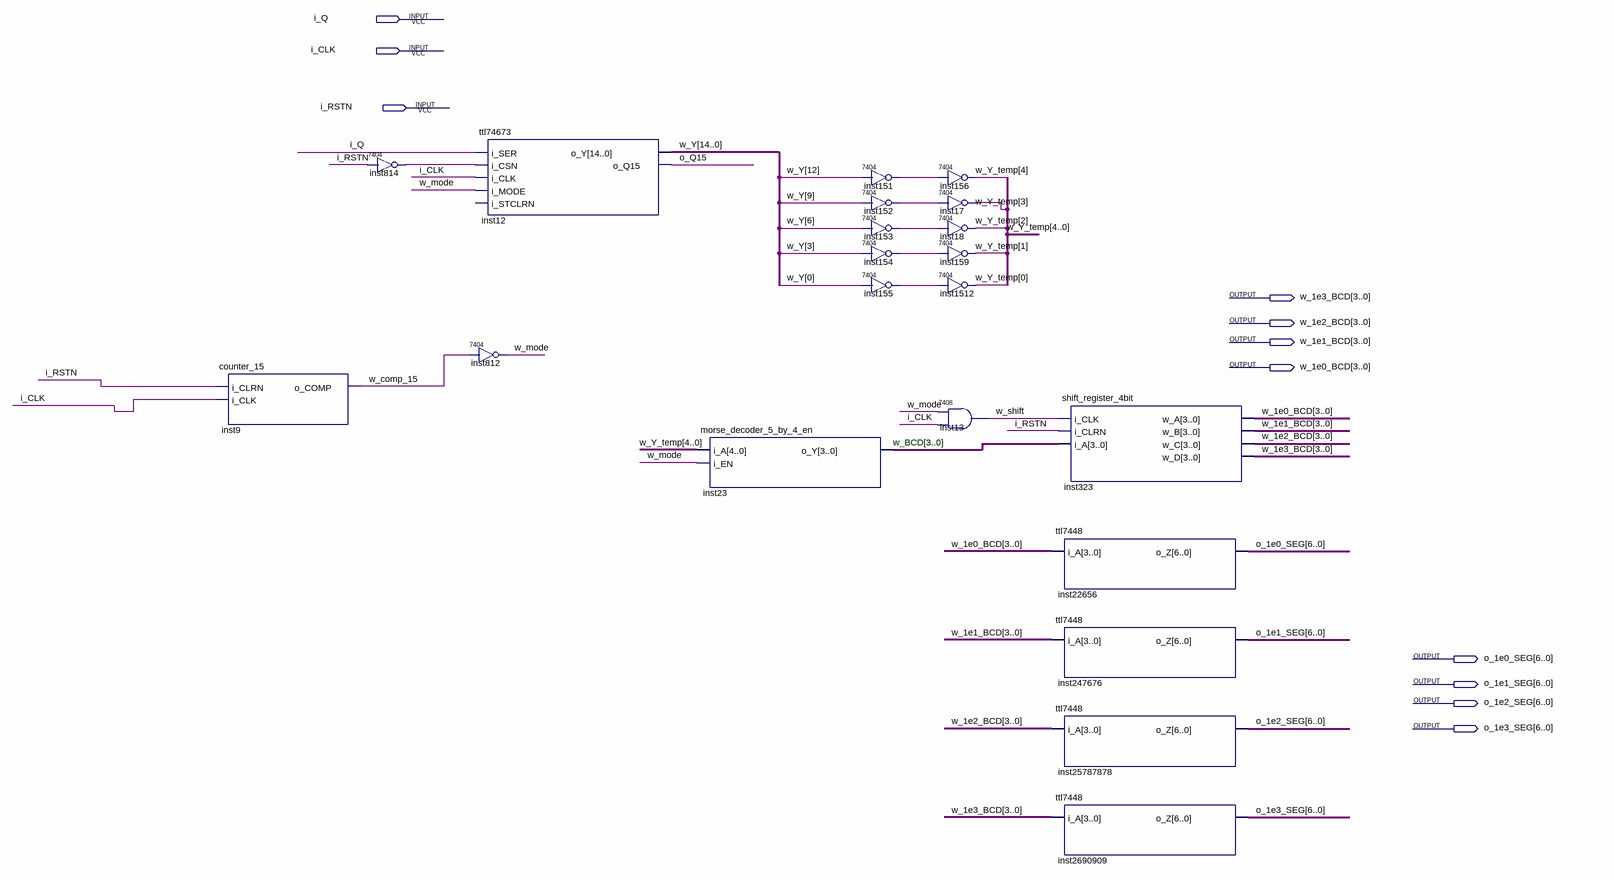
[diagram p0: schematic sheet]
// Quartus schematic receiver.bdf as structural Verilog: 21 symbols, 11 pins
module receiver (
  input  i_Q,
  input  i_CLK,
  input  i_RSTN,
  output [3:0] w_1e3_BCD,
  output [3:0] w_1e2_BCD,
  output [3:0] w_1e1_BCD,
  output [3:0] w_1e0_BCD,
  output [6:0] o_1e0_SEG,
  output [6:0] o_1e1_SEG,
  output [6:0] o_1e2_SEG,
  output [6:0] o_1e3_SEG
);

  wire inst151_1, inst152_1, inst153_1, inst154_1, inst155_1, inst814_1, o_Q15, w_comp_15, w_mode, w_shift;
  wire [3:0] w_BCD;
  wire [4:0] w_Y_temp;
  wire [14:0] w_Y;

  counter_15 inst9 (.i_CLRN(i_RSTN), .i_CLK(i_CLK), .o_COMP(w_comp_15));
  \7404  inst814 (.\2 (i_RSTN), .\1 (inst814_1));
  ttl74673 inst12 (
    .i_SER(i_Q), .i_CSN(inst814_1), .i_CLK(i_CLK), .i_MODE(w_mode), .o_Y(w_Y), .o_Q15(o_Q15));  // open: i_STCLRN
  \7404  inst812 (.\2 (w_comp_15), .\1 (w_mode));
  morse_decoder_5_by_4_en inst23 (.i_A(w_Y_temp), .i_EN(w_mode), .o_Y(w_BCD));
  \7404  inst151 (.\2 (w_Y[12]), .\1 (inst151_1));
  \7404  inst152 (.\2 (w_Y[9]), .\1 (inst152_1));
  \7404  inst153 (.\2 (w_Y[6]), .\1 (inst153_1));
  \7404  inst154 (.\2 (w_Y[3]), .\1 (inst154_1));
  \7404  inst155 (.\2 (w_Y[0]), .\1 (inst155_1));
  \7404  inst156 (.\2 (inst151_1), .\1 (w_Y_temp[4]));
  \7404  inst17 (.\2 (inst152_1), .\1 (w_Y_temp[3]));
  \7404  inst18 (.\2 (inst153_1), .\1 (w_Y_temp[2]));
  \7404  inst159 (.\2 (inst154_1), .\1 (w_Y_temp[1]));
  \7404  inst1512 (.\2 (inst155_1), .\1 (w_Y_temp[0]));
  \7408  inst13 (.\3 (i_CLK), .\2 (w_mode), .\1 (w_shift));
  shift_register_4bit inst323 (
    .i_CLK(w_shift), .i_CLRN(i_RSTN), .i_A(w_BCD), .w_A(w_1e0_BCD), .w_B(w_1e1_BCD), .w_C(w_1e2_BCD),
    .w_D(w_1e3_BCD));
  ttl7448 inst22656 (.i_A(w_1e0_BCD), .o_Z(o_1e0_SEG));
  ttl7448 inst247676 (.i_A(w_1e1_BCD), .o_Z(o_1e1_SEG));
  ttl7448 inst25787878 (.i_A(w_1e2_BCD), .o_Z(o_1e2_SEG));
  ttl7448 inst2690909 (.i_A(w_1e3_BCD), .o_Z(o_1e3_SEG));

  // Notes on the sheet:
  //   w_BCD[3..0]
endmodule
